# EAGLE design hub22_microusb (EAGLE 7.6.0)
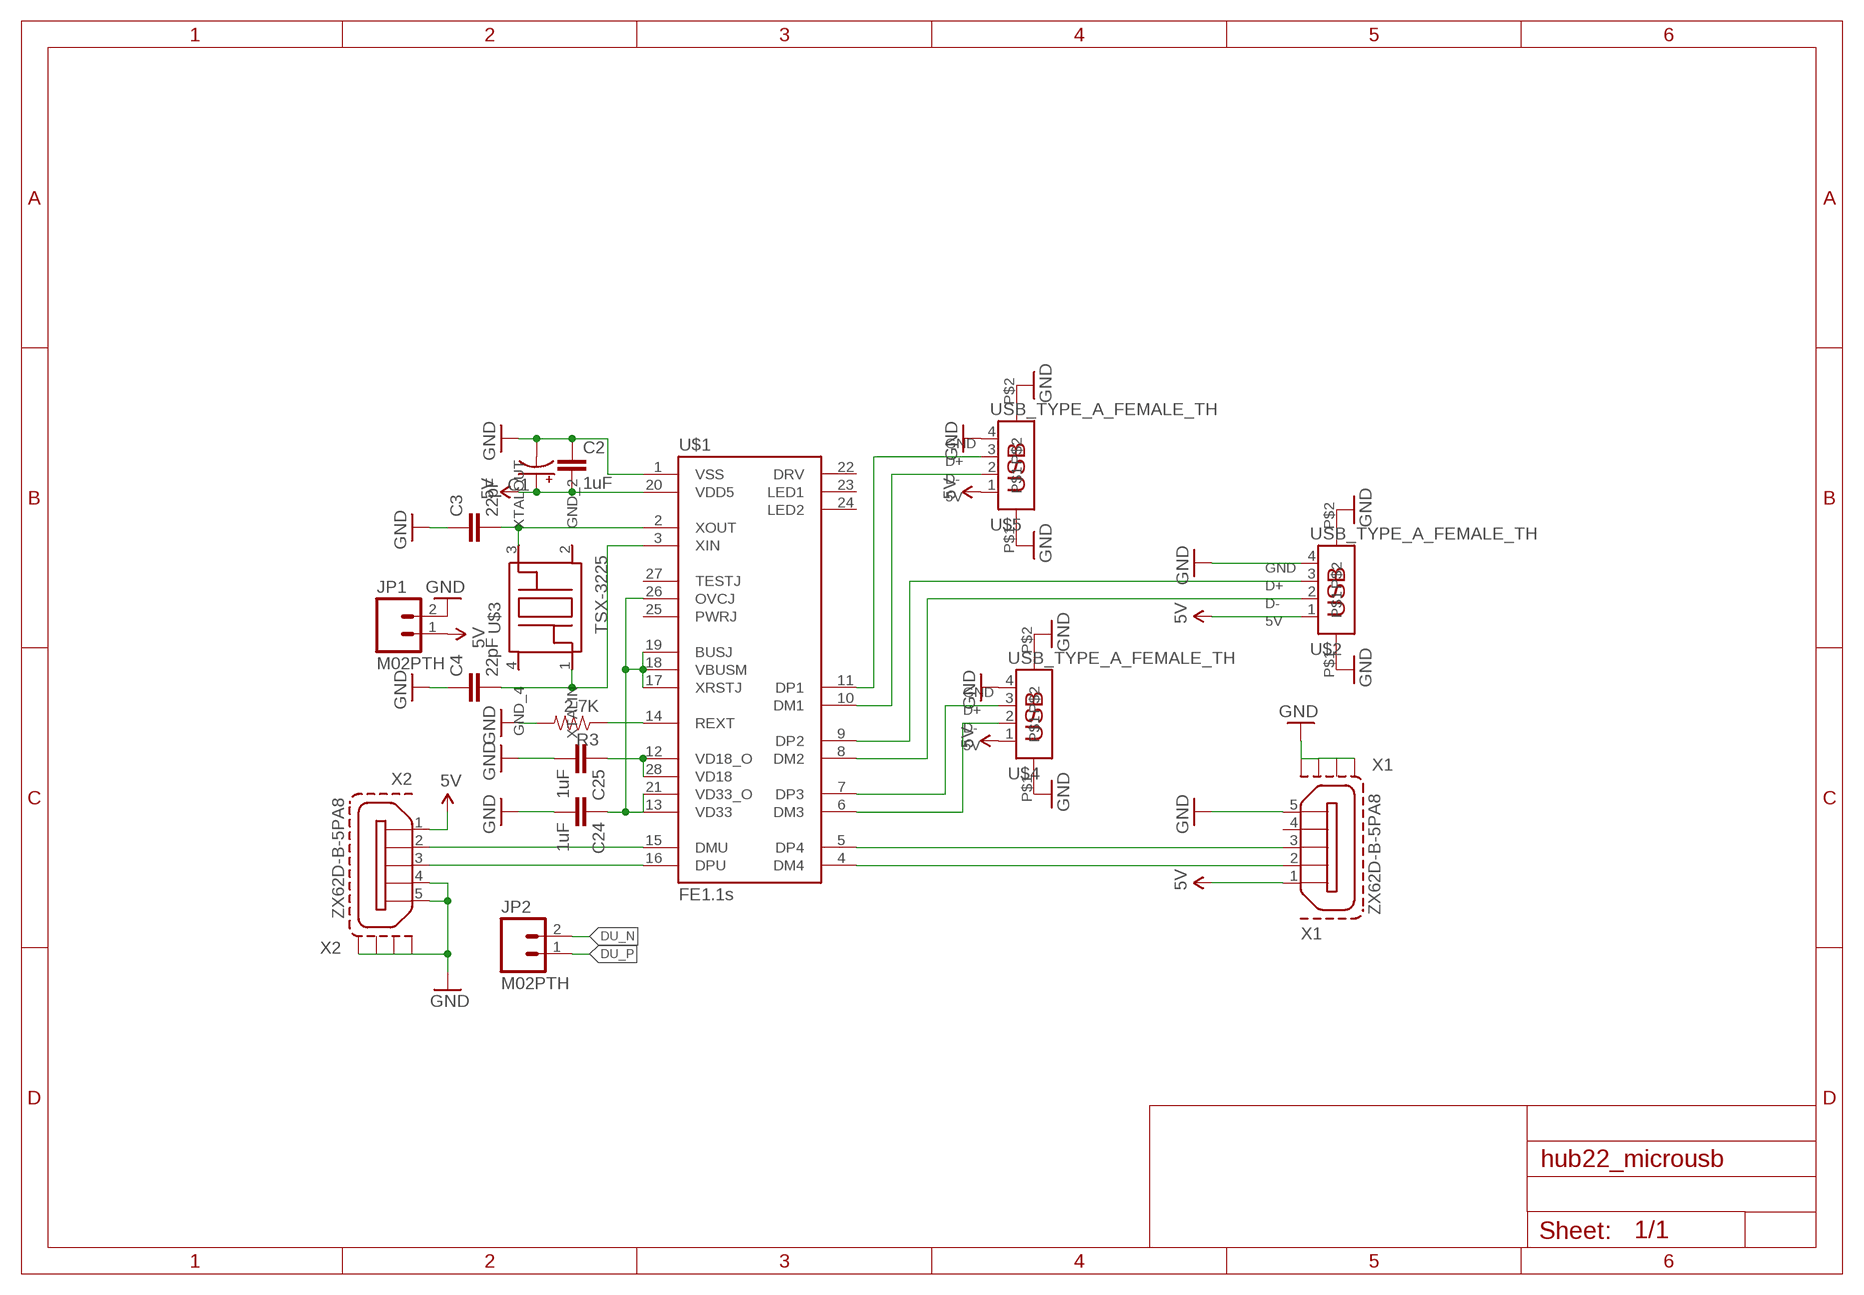
[diagram p0: schematic, sheet 1]

## Parts
C1  CAP_POLD  [PANASONIC_D]
C2  1uF  CAP0805  [0805]
C3  22pF  CAP0805  [0805]
C4  22pF  CAP0805  [0805]
C24  1uF  CAP0805  [0805]
C25  1uF  CAP0805  [0805]
JP1  M02PTH  [1X02]
JP2  M02PTH  [1X02]
R3  2.7K  RESISTOR0805-RES  [0805]
U$1  FE1.1S  [FE1.1S_SSOP-28]
U$2  USB_TYPE_A_FEMALE_TH  [USB_TYPE_A_FEMALE_TH]
U$3  TSX-3225  [TSX-3225]
U$4  USB_TYPE_A_FEMALE_TH  [USB_TYPE_A_FEMALE_TH]
U$5  USB_TYPE_A_FEMALE_TH  [USB_TYPE_A_FEMALE_TH]
X1  ZX62D-B-5PA8  [ZX62D-B-5PA8]
X2  ZX62D-B-5PA8  [ZX62D-B-5PA8]

## Nets
5V: C1.+ C2.2 JP1.1 U$1.20(VDD5) U$2.1 U$4.1 U$5.1 X1.1 X2.1
DU_N: JP2.2 U$1.15(DMU) X2.2
DU_P: JP2.1 U$1.16(DPU) X2.3
GND: C1.- C2.1 C3.1 C4.1 C24.2 C25.2 JP1.2 R3.2 U$1.1(VSS) U$2.4 U$2.P$1 U$2.P$2 U$4.4 U$4.P$1 U$4.P$2 U$5.4 U$5.P$1 U$5.P$2 X1.5 X1.S1 X1.S2 X1.S3 X1.S4 X2.4 X2.5 X2.S1 X2.S2 X2.S3 X2.S4
N$3: C3.2 U$1.2(XOUT) U$3.3(XTALOUT)
N$5: C4.2 U$1.3(XIN) U$3.1(XTALIN)
N$6: C24.1 U$1.13(VD33) U$1.17(XRSTJ) U$1.18(VBUSM) U$1.19(BUSJ) U$1.21(VD33_O) U$1.26(OVCJ)
N$7: R3.1 U$1.14(REXT)
N$15: U$1.4(DM4) X1.2
N$16: U$1.5(DP4) X1.3
N$19: U$1.6(DM3) U$4.2
N$20: U$1.7(DP3) U$4.3
N$21: U$1.8(DM2) U$2.2
N$23: U$1.9(DP2) U$2.3
N$24: U$1.10(DM1) U$5.2
N$33: U$1.11(DP1) U$5.3
N$61: C25.1 U$1.12(VD18_O) U$1.28(VD18)
Unconnected: U$1.22(DRV) U$1.23(LED1) U$1.24(LED2) U$1.25(PWRJ) U$1.27(TESTJ) U$3.2(GND_2) U$3.4(GND_4) X1.4

## Library data of the parts
C1 = SparkFun-Capacitors:CAP_POL: Capacitor Polarized These are standard SMD and PTH capacitors. Normally 10uF, 47uF, and 100uF in electrolytic and tantalum varieties. Always verify the external diameter of the through hole cap, it varies with capacity, voltage, and manufacturer. The EIA devices should be standard.
C2-C4 C24 C25 = SparkFun-Capacitors:CAP: Capacitor Standard 0603 ceramic capacitor, and 0.1" leaded capacitor.
JP1 JP2 = SparkFun-Connectors:M02: Standard 2-pin 0.1" header. Use with - straight break away headers ( PRT-00116) - right angle break away headers (PRT-00553) - swiss pins (PRT-00743) - machine pins (PRT-00117) - female headers (PRT-00115) Molex polarized connector foot print use with: PRT-08233 with associated crimp pins and housings. 2.54_SCREWTERM for use with PRT-10571. 3.5mm Screw Terminal footprints for PRT-08084 5mm Screw Terminal footprints for use with PRT-08433
R3 = SparkFun-Passives:RESISTOR: Resistor Basic schematic elements and footprints for 0603, 1206, and PTH resistors.
U$1 = usb_hub:FE1.1S: A USB 2.0 hub IC. http://www.jfd-ic.com/Documents/FE1.1s%20Data%20Sheet%20%28Rev.%201.0%29.pdf
U$2 U$4 U$5 = usb_hub:USB_TYPE_A_FEMALE_TH: USB Type A Female Through Hole. http://datasheet.octopart.com/787616-1-Tyco-Electronics-datasheet-61477.pdf
U$3 = crystals:TSX-3225
X1 X2 = zx62d-b-5pa8-oshpark_10:ZX62D-B-5PA8: Micro USB Type B Connector - Standard, Shell Through Hole Source: http://www.hirose.co.jp/cataloge_hp/ed_ZX_20140804.pdf; MF: Hirose; MPN: ZX62D-B-5PA8; OC_FARNELL: 2300438; OC_NEWARK: 69W0712

## Board
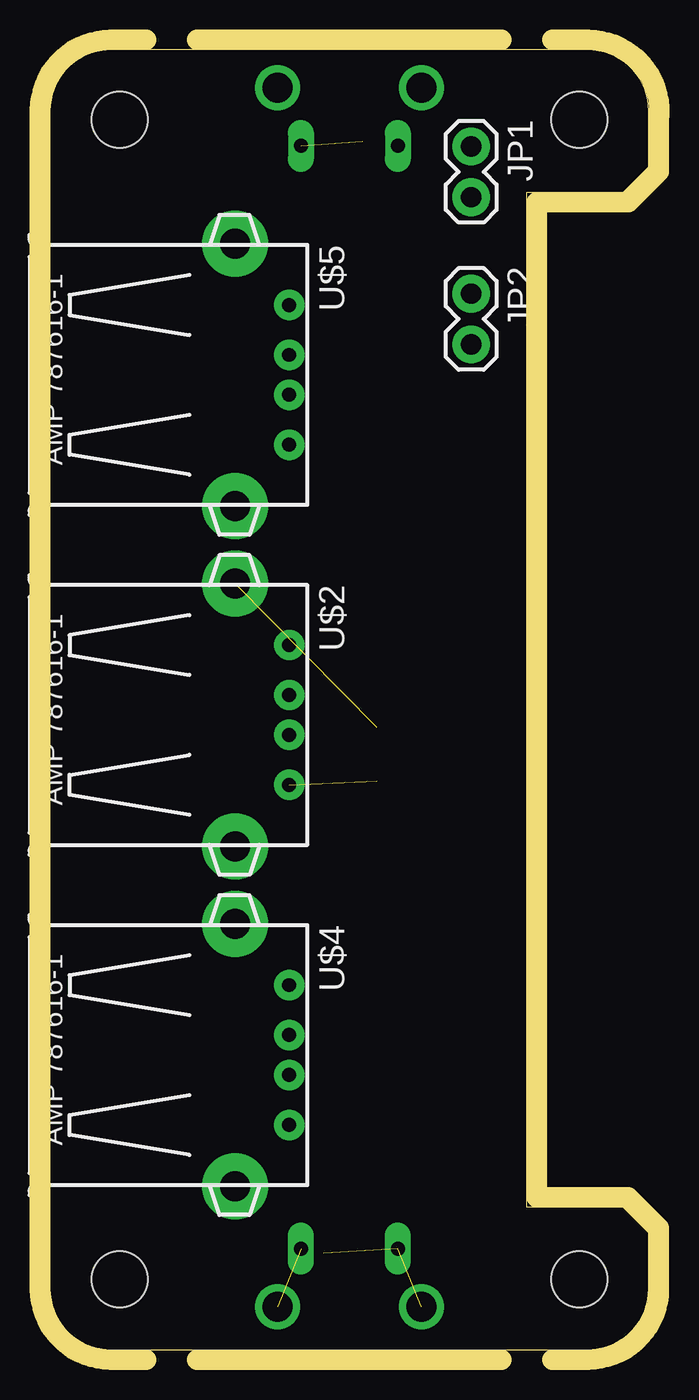
[diagram p1: board, top side]
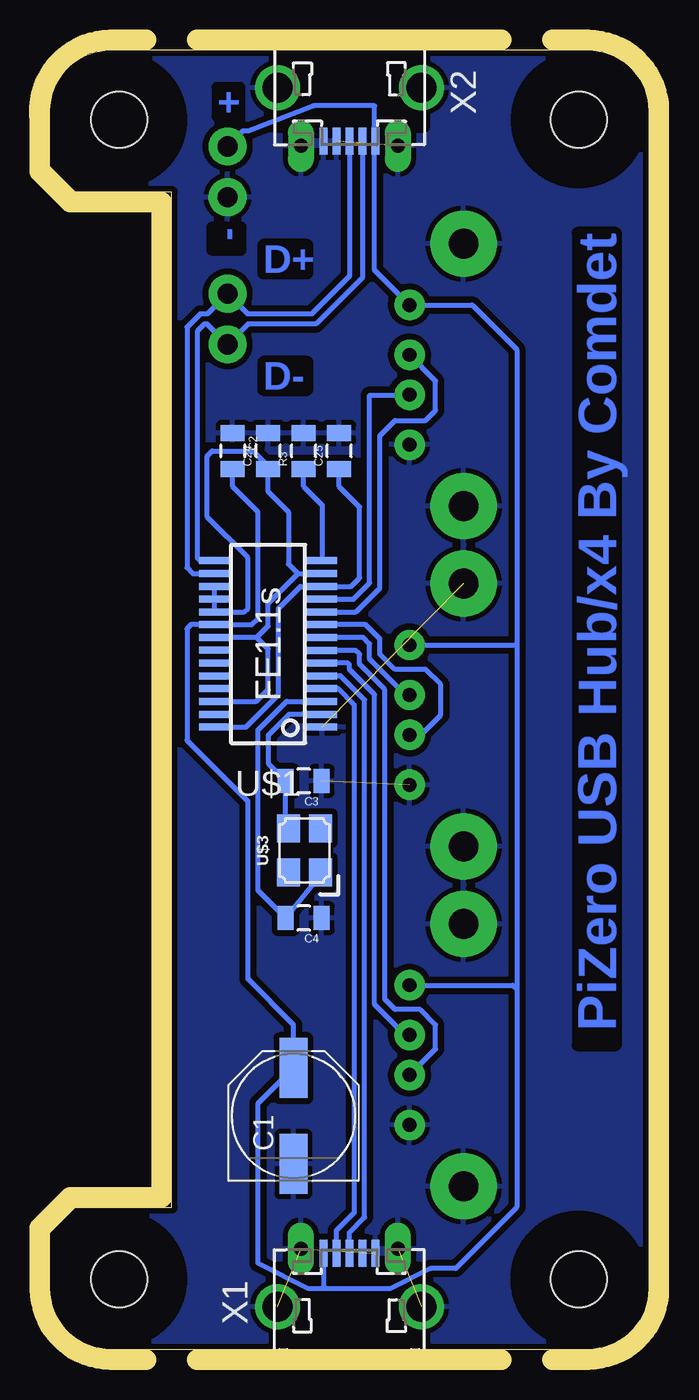
[diagram p2: board, bottom side, seen from below]

Size 29.97 x 65.02 mm. Coordinates in mm from the lower left corner, seen from the top.
Outline: 0,3.05 arc90 3.05,0 26.92,0 arc90 29.97,3.05 29.97,5.84 28.7,7.11 23.88,7.11 23.88,57.91 28.7,57.91 29.97,59.18 29.97,61.98 arc90 26.92,65.02 3.05,65.02 arc90 0,61.98 0,3.05
Copper layers (1*16): Top 0.035mm / dielectric 1.5mm / Bottom 0.035mm
Design rules "SparkFun *": minimum track width 10mil, minimum drill 20mil, track to track 10mil, track to pad 10mil, pad to pad 10mil, via to via 8mil, smd to smd 8mil, copper to edge 10mil, drill to drill 8mil, minimum pad ring 12mil, minimum via ring 10mil, stop-mask expansion 4mil, vias tented up to drill 25mil, thermal gap 10mil
Holes 2.8 mm at 26.5,61.52 3.5,61.52 3.5,3.52 26.5,3.52
bRestrict: area 0.4,58.4 to 6.6,64.6; area 23.4,58.4 to 29.6,64.6; area 23.4,0.4 to 29.6,6.6; area 0.4,0.4 to 6.6,6.6
Milling: 18 lines

### Footprints (pad centres in the part's own frame; a part is rotated, then mirrored left to right if it is on the bottom)
PANASONIC_D = smd 3 x 1.4: + 2.4,0; - -2.4,0
0805 = smd 0.8 x 1.2: 1 -0.9,0; 2 0.9,0
1X02 = drill 1.016 pad 1.88: 1 0,0; 2 2.54,0
FE1.1S_SSOP-28 = smd 0.35 x 1.5: 1 -4.16,-2.7; 2 -3.52,-2.7; 3 -2.88,-2.7; 4 -2.24,-2.7; 5 -1.6,-2.7; 6 -0.96,-2.7; 7 -0.32,-2.7; 8 0.32,-2.7; 9 0.96,-2.7; 10 1.6,-2.7; 11 2.24,-2.7; 12 2.88,-2.7; 13 3.52,-2.7; 14 4.16,-2.7; 15 4.16,2.7; 16 3.52,2.7; 17 2.88,2.7; 18 2.24,2.7; 19 1.6,2.7; 20 0.96,2.7; 21 0.32,2.7; 22 -0.3,2.7; 23 -0.96,2.7; 24 -1.6,2.7; 25 -2.24,2.7; 26 -2.88,2.7; 27 -3.52,2.7; 28 -4.16,2.7
USB_TYPE_A_FEMALE_TH = drill 0.7 pad 1.524: 1 -3.5,5.37; 2 -1,5.37; 3 1,5.37; 4 3.5,5.37 | drill 1.5 pad 3.302: P$1 -6.57,2.66; P$2 6.57,2.66
TSX-3225 = smd 1.4 x 1.15: 1 0,-1.6; 2 2.2,-1.6; 3 2.2,0; 4 0,0
ZX62D-B-5PA8 = smd 1.35 x 0.4: 1 4.825,1.3; 2 4.825,0.65; 3 4.825,0; 4 4.825,-0.65; 5 4.825,-1.3 | drill 1.5: S1 2.15,-3.6; S2 2.15,3.6 | drill 0.7 long: S3 5.05,2.425; S4 5.05,-2.425

### Placement (x,y rotation side)
C1  17.78,11.68 90 bottom
C2  20.83,44.96 270 bottom
C3  17.27,28.45 180 bottom
C4  17.27,21.59 180 bottom
C24  19.05,44.96 90 bottom
C25  15.49,44.96 90 bottom
JP1  21.08,60.2 270 top
JP2  21.08,52.83 270 top
R3  17.27,44.96 90 bottom
U$1  19.05,35.31 90 bottom
U$2  6.6,31.75 270 top
U$3  18.03,23.88 90 bottom
U$4  6.6,14.73 270 top
U$5  6.6,48.77 270 top
X1  14.99,0 90 bottom
X2  14.99,65.28 270 bottom

### Tracks (layer width: path | path; a pad name or v marks a point on that pad's centre or on a via)
5V
  Bottom 0.254: X1.1 16.29,3.08 16.26,3.05 | C2.2 20.83,43.18 19.56,41.91 19.56,36.58 19.87,36.27 U$1.20 22.92,36.27 23.11,36.07 23.11,30.48 20.07,27.43 20.07,18.54 17.78,16.26 C1.+ 19.56,12.31 19.56,4.32 17.02,3.05 16.26,3.05 | 16.26,3.05 12.95,3.05 10.92,4.06 9.65,4.06 6.6,7.11 6.6,18.03 | 6.6,35.25 6.6,50.04 8.83,52.27 U$5.1 13.72,54.01 13.72,60.42 | 6.6,35.25 6.6,18.03 | U$4.1 6.8,18.23 6.6,18.03 | U$2.1 6.6,35.25 | 13.72,60.42 X2.1 | 13.72,60.42 13.72,62.23 16.76,62.23 20.07,60.96 20.32,60.96 JP1.1
DU_N
  Bottom 0.254: 22,39.53 U$1.15 22.45,39.47 22.61,39.62 22.61,50.95 22.25,51.31 22.1,51.31 JP2.2 20.07,51.31 17.02,51.31 16.91,51.31 16.66,51.31 14.34,53.63 X2.2
DU_P
  Bottom 0.254: U$1.16 22.82,38.83 23.11,39.12 23.11,51.16 22.46,51.82 22.1,51.82 JP2.1 20.07,51.82 16.87,51.82 14.99,53.7 X2.3
GND  (6 unrouted)
  pour Bottom (isolate 0.305): -1.02,66.04 31.24,66.04 30.73,-1.02 -1.02,-1.02
N$3
  Bottom 0.254: U$1.2 18,31.79 19.05,30.73 19.05,29.33 C3.2 18.17,26.21 U$3.3
N$5
  Bottom 0.254: U$1.3 18.12,32.43 19.56,30.99 19.56,22.98 C4.2 16.37,23.81 U$3.1
N$6
  Bottom 0.254: U$1.17 U$1.18 U$1.19 20.24,36.91 20.07,37.08 20.07,39.62 22.1,41.66 22.1,44.7 21.84,44.96 19.81,44.96 19.05,44.2 C24.1 19.05,42.93 18.03,41.91 18.03,39.3 17.56,38.83 | 21.02,35.63 U$1.21 19.62,35.63 | U$1.26 19.64,32.43 19.05,33.02 19.05,35.05 19.62,35.63 | 19.62,35.63 19.05,36.2 19.05,37.34 17.56,38.83 | 17.56,38.83 U$1.13
N$7
  Bottom 0.254: R3.1 17.27,43.18 16.35,42.26 U$1.14
N$15
  Bottom 0.254: U$1.4 15.54,33.07 14.73,32.26 14.73,6.86 15.64,5.95 X1.2
N$16
  Bottom 0.254: U$1.5 15.42,33.71 14.22,32.51 14.22,6.6 14.99,5.84 X1.3
N$19
  Bottom 0.254: U$4.2 11.99,15.75 12.19,15.75 13.72,17.27 13.72,32.77 14.99,34.04 14.99,34.29 15.04,34.35 U$1.6
N$20
  Bottom 0.254: U$4.3 10.67,15.04 10.67,16.26 11.43,17.02 12.7,17.02 13.21,17.53 13.21,33.02 14.48,34.29 14.48,34.8 14.67,34.99 U$1.7
N$21
  Bottom 0.254: U$2.2 11.99,32.77 12.19,32.77 13.97,34.54 13.97,35.31 14.29,35.63 U$1.8
N$23
  Bottom 0.254: U$2.3 11.41,30.75 10.41,31.75 10.41,33.27 11.18,34.04 12.7,34.04 13.46,34.8 13.46,35.56 14.17,36.27 U$1.9
N$24
  Bottom 0.254: U$1.10 14.66,36.91 13.46,38.1 13.46,45.72 12.7,46.48 11.18,46.48 10.67,46.99 10.67,48.46 U$5.2
N$33
  Bottom 0.254: U$1.11 14.78,37.55 13.97,38.35 13.97,47.75 11.97,47.75 U$5.3 12.43,47.77
N$61
  Bottom 0.254: U$1.28 20.16,31.15 18.54,32.77 18.54,37.08 17.44,38.19 U$1.12 14.9,38.19 14.48,38.61 14.48,42.16 15.49,43.18 C25.1

### Text on the board
Bottom: + | PiZero USB Hub/x4 By Comdet | - | D+ | D-